# EAGLE schematic submarine (EAGLE 9.6.2)
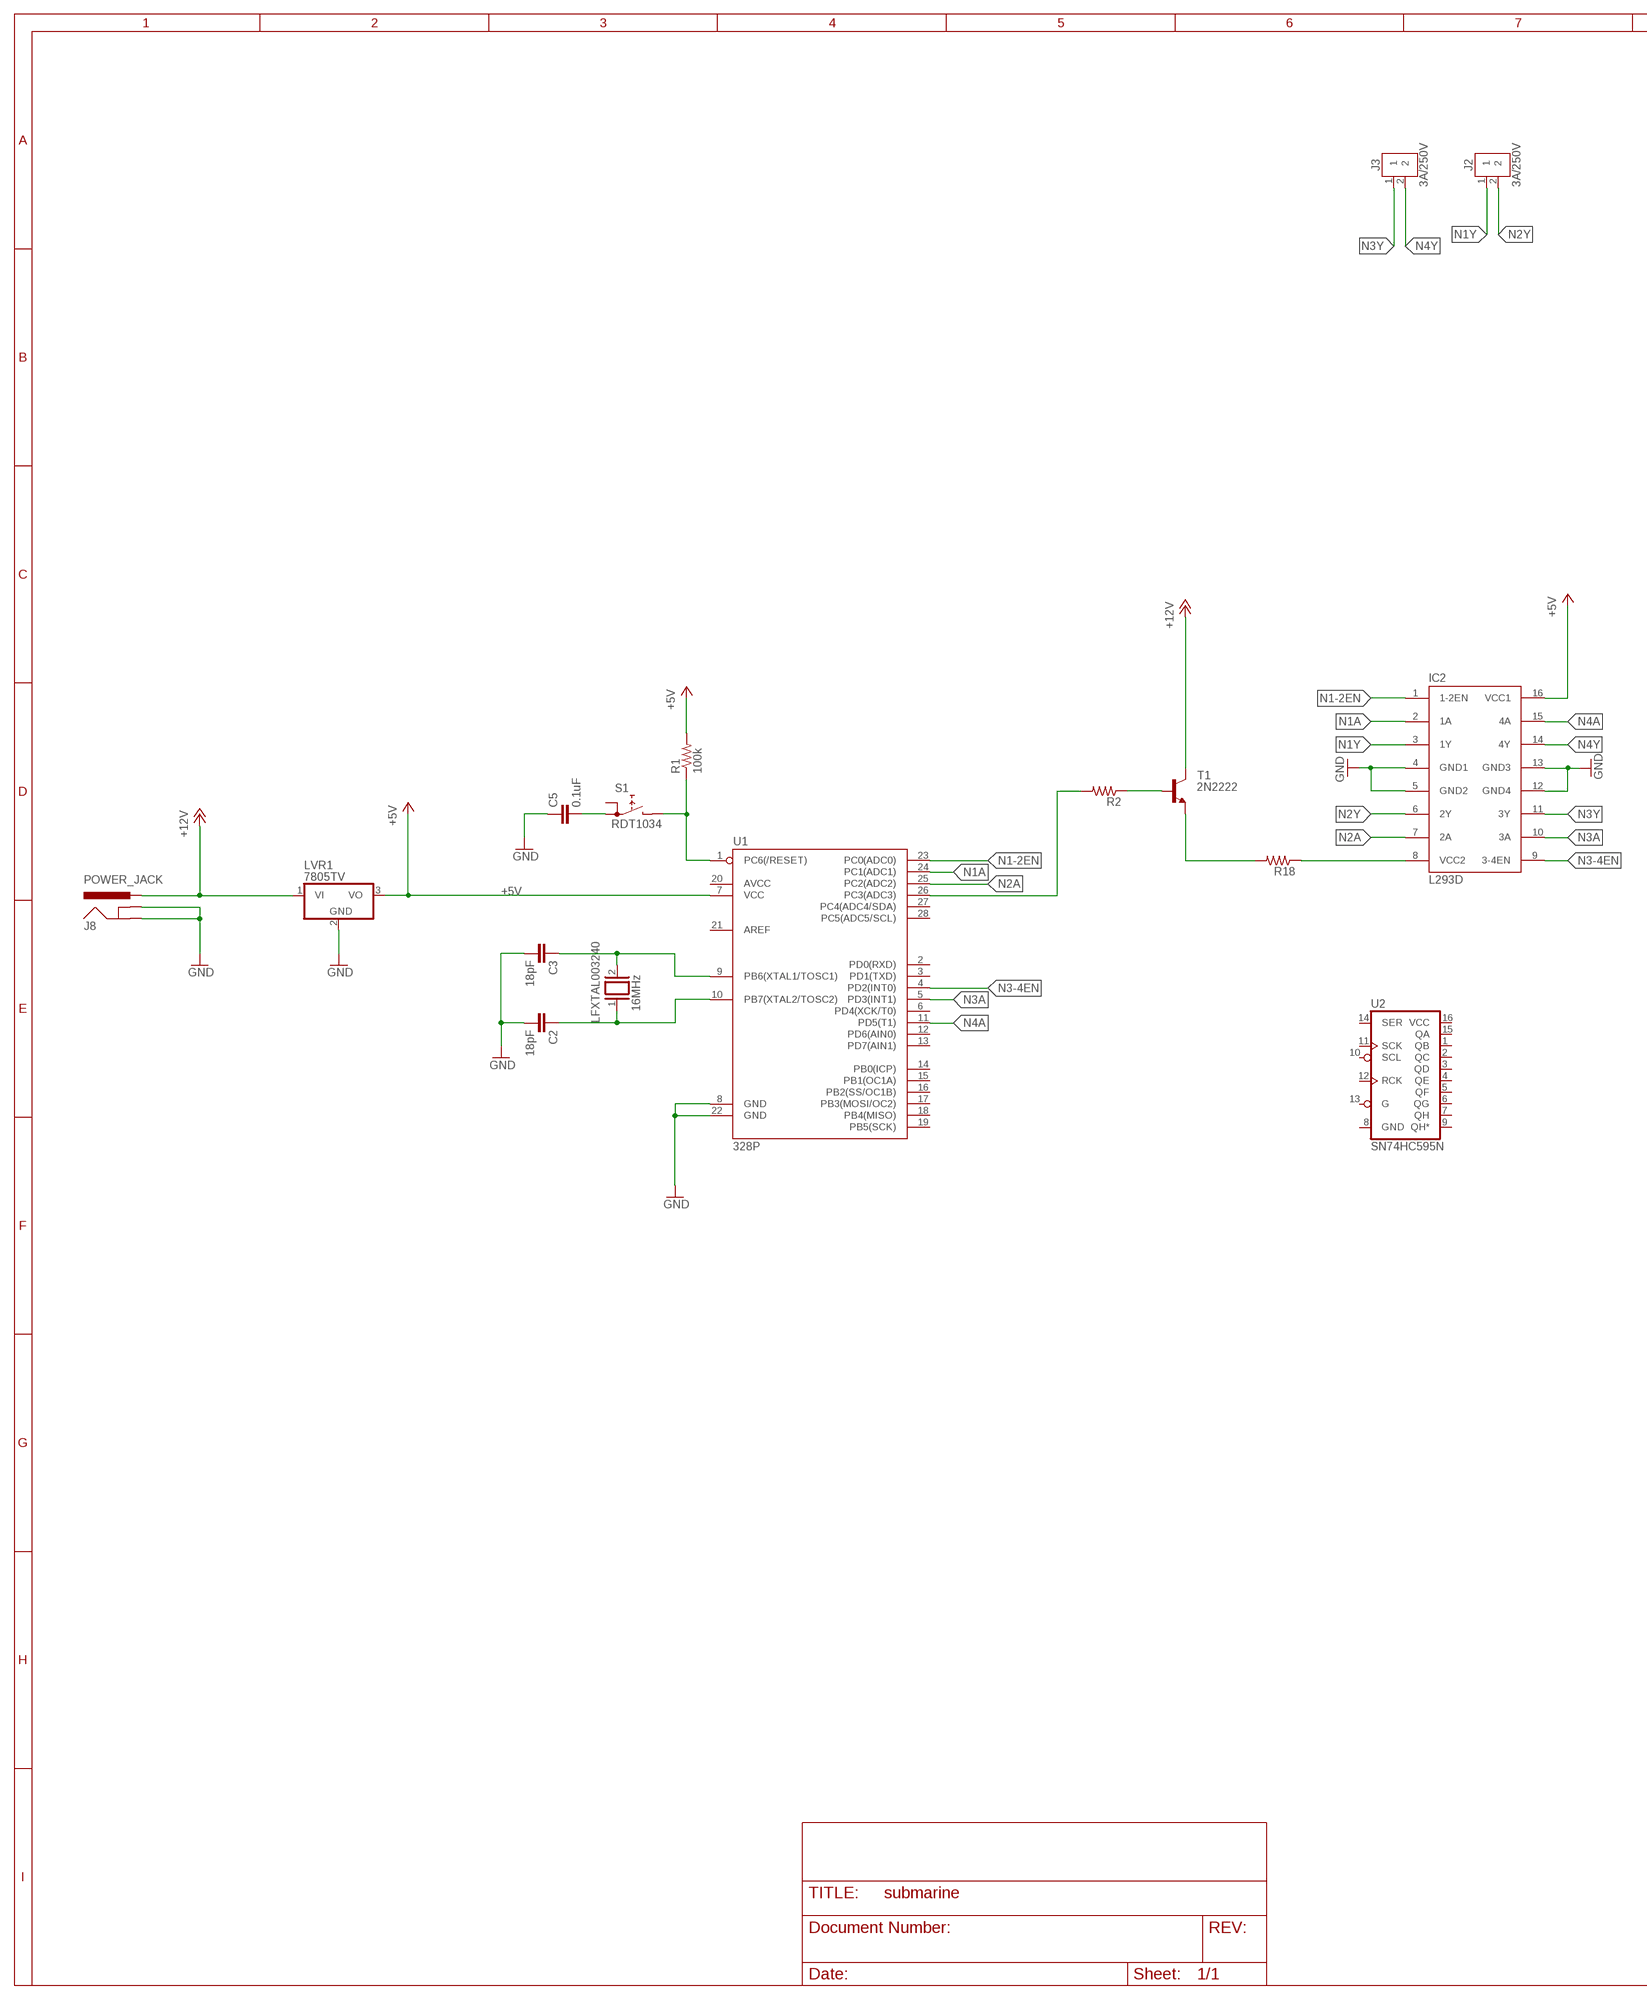
[diagram p0: schematic, sheet 1, part 1 of 2]
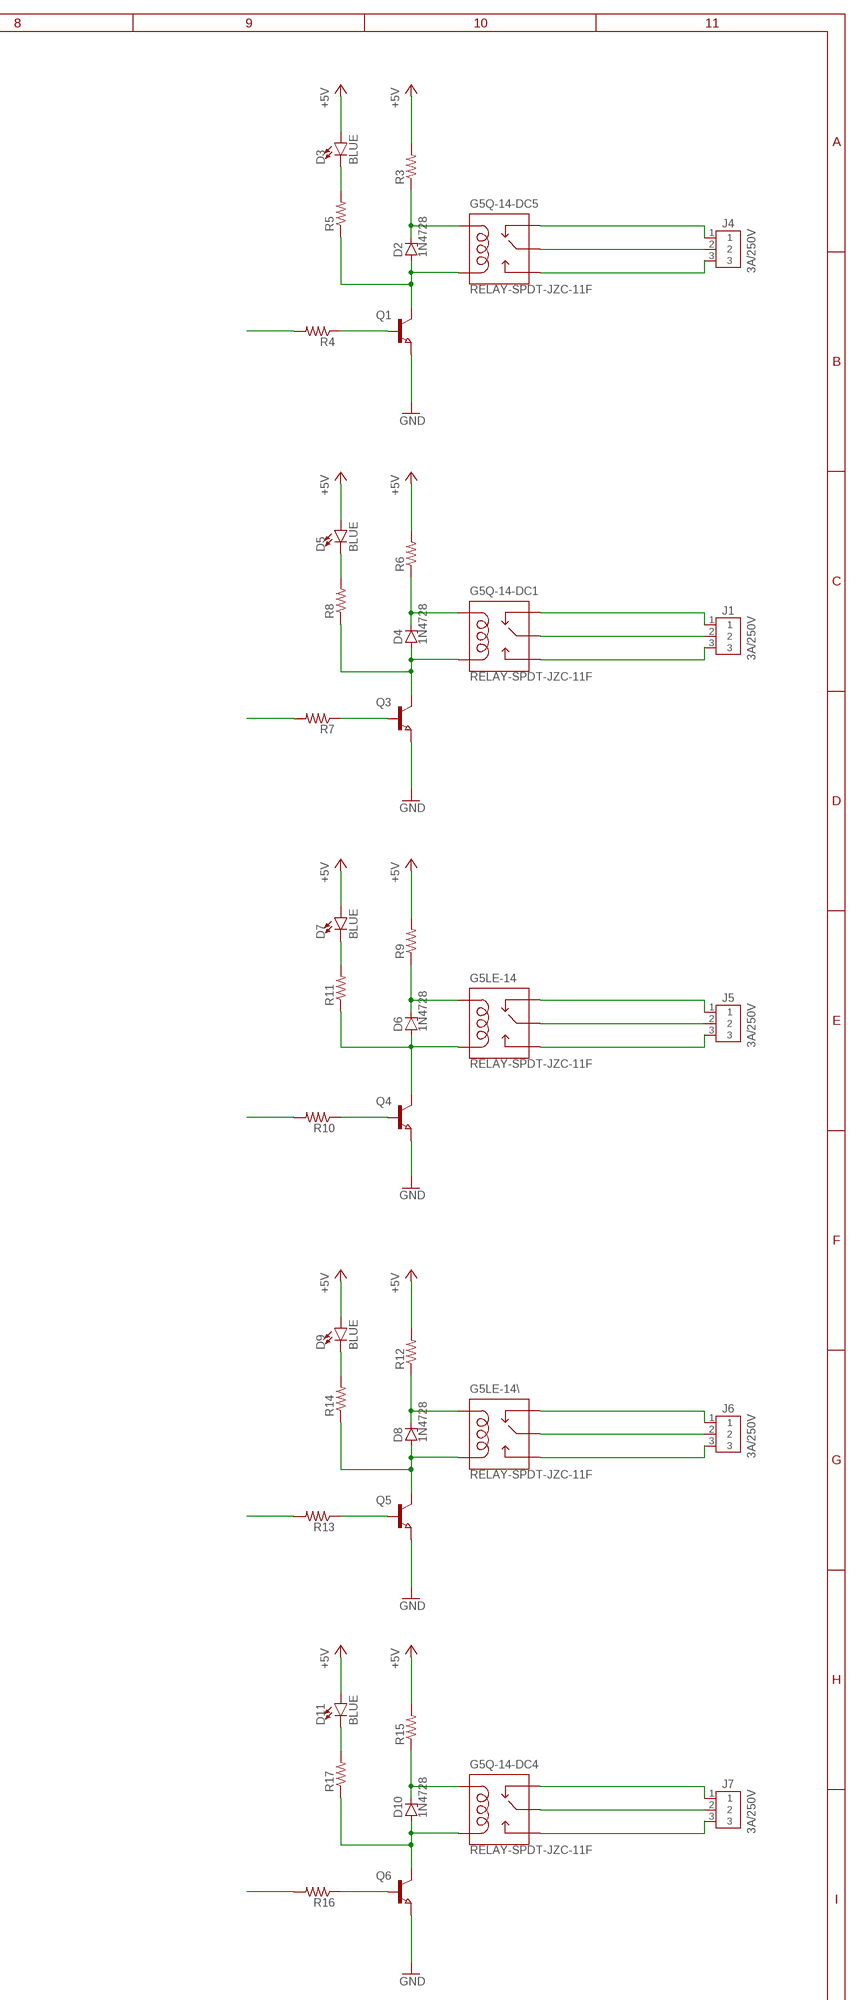
[diagram p1: schematic, sheet 1, part 2 of 2]

## Parts
C2  18pF  C-EU025-024X044  [C025-024X044]
C3  18pF  C-EU025-024X044  [C025-024X044]
C5  0.1uF  C-EU025-024X044  [C025-024X044]
D2  1N4728  [DO41Z10]
D3  BLUE  LED-BLUE0603  [LED-0603]
D4  1N4728  [DO41Z10]
D5  BLUE  LED-BLUE0603  [LED-0603]
D6  1N4728  [DO41Z10]
D7  BLUE  LED-BLUE0603  [LED-0603]
D8  1N4728  [DO41Z10]
D9  BLUE  LED-BLUE0603  [LED-0603]
D10  1N4728  [DO41Z10]
D11  BLUE  LED-BLUE0603  [LED-0603]
G5LE-14  RELAY-SPDT-JZC-11F  [RELAY-JZC]
G5LE-14\  RELAY-SPDT-JZC-11F  [RELAY-JZC]
G5Q-14-DC1  RELAY-SPDT-JZC-11F  [RELAY-JZC]
G5Q-14-DC4  RELAY-SPDT-JZC-11F  [RELAY-JZC]
G5Q-14-DC5  RELAY-SPDT-JZC-11F  [RELAY-JZC]
IC2  L293D  [DIL16]
J1  3A/250V  B3B-XH-A  [B3B-XH-A]
J2  3A/250V  B2B-XH-A  [B2B-XH-A]
J3  3A/250V  B2B-XH-A  [B2B-XH-A]
J4  3A/250V  B3B-XH-A  [B3B-XH-A]
J5  3A/250V  B3B-XH-A  [B3B-XH-A]
J6  3A/250V  B3B-XH-A  [B3B-XH-A]
J7  3A/250V  B3B-XH-A  [B3B-XH-A]
J8  POWER_JACK  [POWER_JACK_PTH]
LFXTAL003240  16MHz  XTAL  [Q]
LVR1  7805TV  [TO220V]
Q1  NPN-TRANSISTOR_SOT23  [SOT23]
Q3  NPN-TRANSISTOR_SOT23  [SOT23]
Q4  NPN-TRANSISTOR_SOT23  [SOT23]
Q5  NPN-TRANSISTOR_SOT23  [SOT23]
Q6  NPN-TRANSISTOR_SOT23  [SOT23]
R1  100k  R-US_0207/10  [0207/10]
R2  R-US_0207/10  [0207/10]
R3  R-US_0207/10  [0207/10]
R4  R-US_0207/10  [0207/10]
R5  R-US_0207/10  [0207/10]
R6  R-US_0207/10  [0207/10]
R7  R-US_0207/10  [0207/10]
R8  R-US_0207/10  [0207/10]
R9  R-US_0207/10  [0207/10]
R10  R-US_0207/10  [0207/10]
R11  R-US_0207/10  [0207/10]
R12  R-US_0207/10  [0207/10]
R13  R-US_0207/10  [0207/10]
R14  R-US_0207/10  [0207/10]
R15  R-US_0207/10  [0207/10]
R16  R-US_0207/10  [0207/10]
R17  R-US_0207/10  [0207/10]
R18  R-US_0207/10  [0207/10]
S1  RDT1034  [RDT1034]
T1  2N2222  [TO18]
U1  328P  ATMEGA328P_PDIP  [DIP28]
U2  SN74HC595N  74HC595N  [DIP16]

## Nets
+5V: D3.A D5.A D7.A D9.A D11.A IC2.16(VCC1) LVR1.3(VO) R1.2 R3.2 R6.2 R9.2 R12.2 R15.2 U1.7(VCC)
+12V: J8.PWR LVR1.1(VI) T1.3(C)
GND: C2.2 C3.2 C5.1 IC2.4(GND1) IC2.5(GND2) IC2.12(GND4) IC2.13(GND3) J8.GND J8.GNDBREAK LVR1.2(GND) Q1.2(E) Q3.2(E) Q4.2(E) Q5.2(E) Q6.2(E) U1.8(GND) U1.22(GND)
N1-2EN: IC2.1(1-2EN) U1.23(PC0(ADC0))
N1A: IC2.2(1A) U1.24(PC1(ADC1))
N1Y: IC2.3(1Y) J2.1
N2A: IC2.7(2A) U1.25(PC2(ADC2))
N2Y: IC2.6(2Y) J2.2
N3-4EN: IC2.9(3-4EN) U1.4(PD2(INT0))
N3A: IC2.10(3A) U1.5(PD3(INT1))
N3Y: IC2.11(3Y) J3.1
N4A: IC2.15(4A) U1.11(PD5(T1))
N4Y: IC2.14(4Y) J3.2
N$1: C3.1 LFXTAL003240.2 U1.9(PB6(XTAL1/TOSC1))
N$2: C2.1 LFXTAL003240.1 U1.10(PB7(XTAL2/TOSC2))
N$3: R1.1 S1.B U1.1(PC6(/RESET))
N$4: C5.2 S1.A1
N$5: R2.1 T1.2(B)
N$6: D2.C G5Q-14-DC5.5(COIL1) R3.1
N$7: D2.A G5Q-14-DC5.1(COIL2) Q1.3(C) R5.1
N$8: Q1.1(B) R4.1
N$9: R4.2
N$10: D3.C R5.2
N$11: G5Q-14-DC5.2(NC) J4.1
N$12: G5Q-14-DC5.4(MAIN) J4.2
N$13: G5Q-14-DC5.3(NO) J4.3
N$14: D4.C G5Q-14-DC1.5(COIL1) R6.1
N$15: D4.A G5Q-14-DC1.1(COIL2) Q3.3(C) R8.1
N$16: Q3.1(B) R7.1
N$17: D5.C R8.2
N$18: R7.2
N$19: G5Q-14-DC1.2(NC) J1.1
N$20: G5Q-14-DC1.4(MAIN) J1.2
N$21: G5Q-14-DC1.3(NO) J1.3
N$22: D6.C G5LE-14.5(COIL1) R9.1
N$23: D6.A G5LE-14.1(COIL2) Q4.3(C) R11.1
N$24: Q4.1(B) R10.1
N$25: D7.C R11.2
N$26: R10.2
N$27: G5LE-14.2(NC) J5.1
N$28: G5LE-14.4(MAIN) J5.2
N$29: G5LE-14.3(NO) J5.3
N$30: D8.C G5LE-14\.5(COIL1) R12.1
N$31: D8.A G5LE-14\.1(COIL2) Q5.3(C) R14.1
N$32: Q5.1(B) R13.1
N$33: D9.C R14.2
N$34: R13.2
N$35: G5LE-14\.2(NC) J6.1
N$36: G5LE-14\.4(MAIN) J6.2
N$37: G5LE-14\.3(NO) J6.3
N$38: D10.C G5Q-14-DC4.5(COIL1) R15.1
N$39: D10.A G5Q-14-DC4.1(COIL2) Q6.3(C) R17.1
N$40: Q6.1(B) R16.1
N$41: D11.C R17.2
N$42: R16.2
N$43: G5Q-14-DC4.2(NC) J7.1
N$44: G5Q-14-DC4.4(MAIN) J7.2
N$45: G5Q-14-DC4.3(NO) J7.3
N$46: R2.2 U1.26(PC3(ADC3))
N$47: R18.2 T1.1(E)
N$48: IC2.8(VCC2) R18.1
Unconnected: S1.A U1.2(PD0(RXD)) U1.3(PD1(TXD)) U1.6(PD4(XCK/T0)) U1.12(PD6(AIN0)) U1.13(PD7(AIN1)) U1.14(PB0(ICP)) U1.15(PB1(OC1A)) U1.16(PB2(SS/OC1B)) U1.17(PB3(MOSI/OC2)) U1.18(PB4(MISO)) U1.19(PB5(SCK)) U1.20(AVCC) U1.21(AREF) U1.27(PC4(ADC4/SDA)) U1.28(PC5(ADC5/SCL)) U2.1(QB) U2.2(QC) U2.3(QD) U2.4(QE) U2.5(QF) U2.6(QG) U2.7(QH) U2.9(QH*) U2.10(SCL) U2.11(SCK) U2.12(RCK) U2.13(G) U2.14(SER) U2.15(QA)

## Power pins joined to a net without a drawn wire
GND: U2.8(GND)
VCC: U2.16(VCC)

## Library data of the parts
C2 C3 C5 = rcl:C-EU: CAPACITOR, European symbol; SPICEPREFIX: C
D2 D4 D6 D8 D10 = diode:1N4728: Z DIODE 3.3 V, 1W, 5 percent
D3 D5 D7 D9 D11 = SparkFun-LED:LED-BLUE: Blue SMD LED Used in manufacturing of various products at SparkFun Packages: 0603 - SMD 0603 package [Product Link] <http://www.digikey.com/product-detail/en/SMLE12BC7TT86/511-1589-2-ND/1641808> 1206 - SMD1206 package [Product Link] <http://www.digikey.com/product-detail/en/lite-on-inc/LTST-C150TBKT/160-1643-1-ND/573584> SparkFun Products: ESP8266 Thing-Dev Board <https://www.sparkfun.com/products/13711> RedBoard <https://www.sparkfun.com/products/12757>; PROD_ID: DIO-08575
G5LE-14 G5LE-14\ G5Q-14-DC1 G5Q-14-DC4 G5Q-14-DC5 = G5Q-14-DC5:RELAY-SPDT: SPDT Electromechanical Relay Single-pole, double-throw sealed relays. When current is applied to the coil, it throws a simple changeover switch, terminating the connection from the NC contact to ground and closing the NO contact. Use them to switch high voltage/high current devices. SparkFun Products JQX-15F: Relay SPDT Sealed - 20A <https://www.sparkfun.com/products/10924> (COM-10924) JZC-11F: Relay SPDT Sealed <https://www.sparkfun.com/products/100> (COM-00100); PROD_ID: COMP-09533; SF_SKU: COM-00100
IC2 = st-microelectronics:L293D: PUSH-PULL 4 CHANNEL DRIVER; MPN: L293D; OC_FARNELL: 9589619; OC_NEWARK: 56P8249
J1 J4-J7 = Connector:B3B-XH-A: XH Connector Top Entry - 3POS Details see: Datasheet <http://www.jst-mfg.com/product/pdf/eng/eXH.pdf>; CATEGORY: CONNECTOR; DESCRIPTION: 2.5mm pitch/disconnectable crimp style connector; MANUFACTURER: JST (XH connector); MPN: B3B-XH-A; PART_STATUS: ACTIVE; ROHS_COMPLIANT: COMPLIANT; SERIES: B3B-XH-A; SUB_CATEGORY: THROUGH HOLE CONNECTOR; TYPE: SIDE ENTRY
J2 J3 = Connector:B2B-XH-A: XH Connector Top Entry - 2POS Details see: Datasheet <http://www.jst-mfg.com/product/pdf/eng/eXH.pdf>; CATEGORY: CONNECTOR; DESCRIPTION: 2.5mm pitch/disconnectable crimp style connector; MANUFACTURER: JST (XH CONNECTOR); MPN: B2B-XH-A; OPERATING_TEMPERATURE: -25°C ~ 85°C; PART_STATUS: ACTIVE; ROHS_COMPLIANT: COMPLIANT; SERIES: B_B-XH-A; SUB_CATEGORY: Through hole connector; TYPE: top entry
J8 = SparkFun-Connectors:POWER_JACK: Power Jack Connector This is the standard 5.5mm barrel jack for power. The PTH is the most common, proven, reliable, footprint. The Slot footprint only works if the mill layer is transmitted to the PCB fab house so be warned. Here are the connectors we sell at SparkFun: DC Barrel Power Jack/Connector <https://www.sparkfun.com/products/119> (PRT-00119) DC Barrel Power Jack/Connector (SMD) <https://www.sparkfun.com/products/12748> (PRT-12748) DC Barrel Jack Adapter - Breadboard Compatible <https://www.sparkfun.com/products/10811> (PRT-10811) It is used on this SparkFun product (and many, many others): SparkFun RedBoard - Programmed with Arduino <https://www.sparkfun.com/products/12757> (DEV-12757) Also, if you need a mating power supply or connector, please check these out: Wall Adapter Power Supply - 9VDC 650mA <https://www.sparkfun.com/products/298> (TOL-00298) DC Barrel Jack Adapter - Male <https://www.sparkfun.com/products/10287> (PRT-10287); PROD_ID: CONN-08197
LFXTAL003240 = special:XTAL: CRYSTAL
LVR1 = linear:78*: Positive VOLTAGE REGULATOR Source: http://cache.national.com/ds/LM/LM78L05.pdf http://www.fairchildsemi.com/ds/LM/LM7805.pdf
Q1 Q3-Q6 = semicon-smd-ipc:NPN-TRANSISTOR_: NPN TRANSISTOR
R1-R18 = rcl:R-US_: RESISTOR, American symbol; SPICEPREFIX: R
S1 = switch:RDT1034: PUSH SWITCH www.radiohm.com
T1 = transistor:2N2222: NPN TRANSISTOR
U1 = SparkFun-IC-Microcontroller:ATMEGA328P_PDIP: Atmel 328P Through hole ATMEGA328P uC used in the Arduino 32kb flash, 1k EEPROM, 2k SRAM Datasheet <http://www.sparkfun.com/datasheets/Components/SMD/ATMega328.pdf> SparkFun Products Storefront component: AVR 28 Pin 20MHz 32K 6A/D - ATMega328P <https://www.sparkfun.com/products/9061> (COM-09061) SparkFun Simon Says - Through-Hole Soldering Kit <https://www.sparkfun.com/products/10547> (KIT-10547) SparkFun Learn to Solder - Simon Says <https://www.sparkfun.com/products/13708> (KIT-13708) SparkFun BigTime Watch Kit <https://www.sparkfun.com/products/11734> (KIT-11734) SparkFun ClockIt <https://www.sparkfun.com/products/10930> (KIT-10930) SparkFun Serial Enabled LCD Kit <https://www.sparkfun.com/products/10097> (LCD-10097) SparkFun Simon Tilts - Through Hole Soldering Kit <https://www.sparkfun.com/products/12634> (KIT-12634) SparkFun Frequency Counter Kit <https://www.sparkfun.com/products/10140> (KIT-10140) FabFM Radio Kit <https://www.sparkfun.com/products/11043> (KIT-11043) SparkFun Binary Blaster Kit <https://www.sparkfun.com/products/12037> (KIT-12037) SparkFun Metro-Gnome <https://www.sparkfun.com/products/9236> (KIT-09236) ATmega328 with Arduino Optiboot (Uno) <https://www.sparkfun.com/products/10524> (DEV-10524); PROD_ID: IC-09136
U2 = SparkFun-IC-Logic:74*595: 8-Bit Shift Register (Serial to Parallel) Datasheet <http://cdn.sparkfun.com/datasheets/BreakoutBoards/MM74HC595.pdf> SparkFun Products SparkFun Shift Register Breakout - 74HC595 <https://www.sparkfun.com/products/10680> (BOB-10680); PROD_ID: IC-13123